# Altium schematic sheet JTAG_Connector.SchDoc
size A3
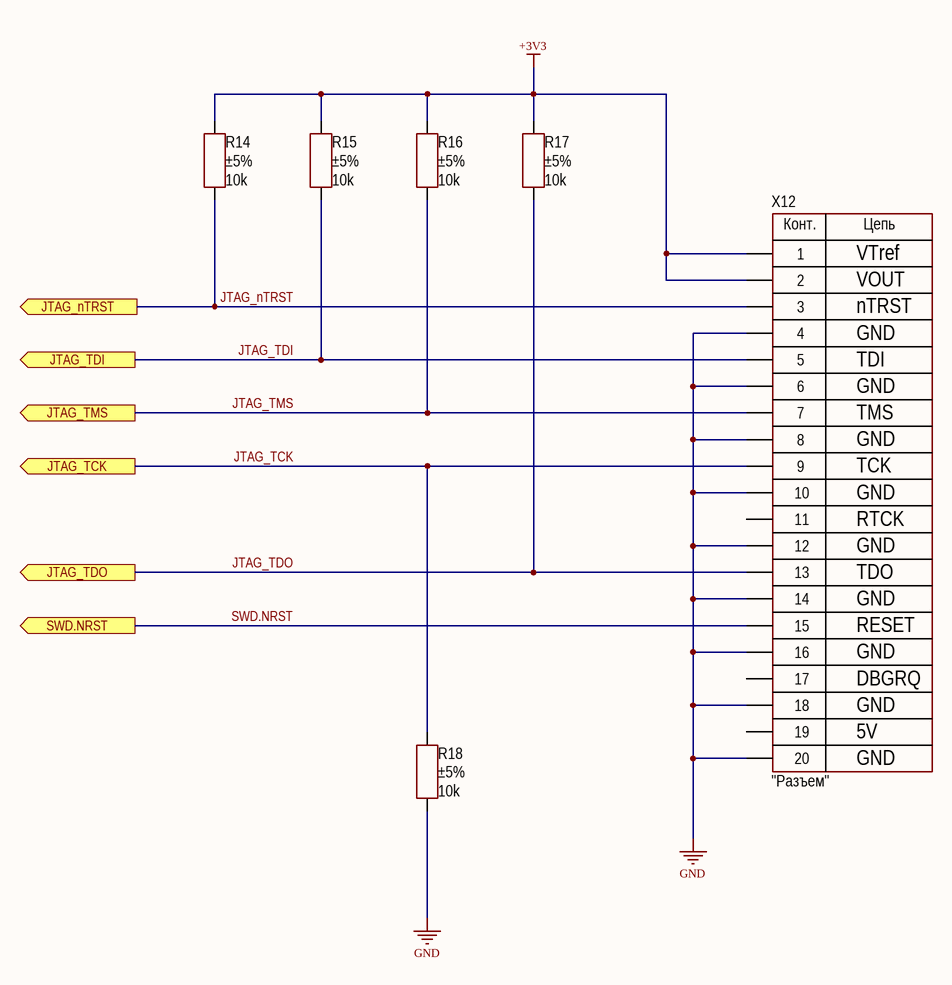
[diagram p0: JTAG_Connector.SchDoc]

## Parts
R14  value 10k  Tolerance: ±5%  [RES: 1206]
R15  value 10k  Tolerance: ±5%  [RES: 1206]
R16  value 10k  Tolerance: ±5%  [RES: 1206]
R17  value 10k  Tolerance: ±5%  [RES: 1206]
R18  value 10k  Tolerance: ±5%  [RES: 1206]
X12  CommentText: "Разъем"  [CON: IDC-20MS]

## Ports
JTAG_nTRST (out), JTAG_TCK (out), JTAG_TDI (out), JTAG_TDO (out), JTAG_TMS (out), SWD.NRST (out)

## Nets
+3V3: R14.2 R15.2 R16.2 R17.2 X12.1 X12.2
GND: R18.1 X12.4 X12.6 X12.8 X12.10 X12.12 X12.14 X12.16 X12.18 X12.20
JTAG_nTRST: R14.1 X12.3 ; port JTAG_nTRST
JTAG_TCK: R18.2 X12.9 ; port JTAG_TCK
JTAG_TDI: R15.1 X12.5 ; port JTAG_TDI
JTAG_TDO: R17.1 X12.13 ; port JTAG_TDO
JTAG_TMS: R16.1 X12.7 ; port JTAG_TMS
SWD.NRST: X12.15 ; port SWD.NRST

Not connected (* = marked no-connect by the designer): X12 11 17 19

## Notes on the sheet
- VTref
- VOUT
- nTRST
- GND
- TDI
- TMS
- TCK
- RTCK
- TDO
- RESET
- DBGRQ
- 5V
- (in symbol IDC-20) Конт.; Цепь

## Library data of the parts
R14-R18 = Resistor_1206: Manufacturer: Yageo; PartNumber: RC1206JR-07100RL; ValueManufacturerPartNumber: Resistor film, 10k, ±5%, 1206, 0.25W, -55...+125°C; TypeResistor: Resistor film; Power: 0.25W; Package: 1206; HelpURL: https://www.digikey.com/product-detail/en/yageo/RC1206JR-07100RL/311-100ERCT-ND/732153; Temperature: -55...+125°C
X12 = IDC-20: Manufacturer: Connfly; ValueManufacturerPartNumber: Connector, 20pin, 2.54mm, 250VAC, 3A; TypeConnector: Connector; VoltageMax: 250VAC; Pitch: 2.54mm; CurrentMax: 3A; Multichannel: 20pin; HelpURL: https://www.chipdip.ru/product/idc-20ms; PartNumber: IDC-20